# Altium project SmartCar3.0.PrjPCB
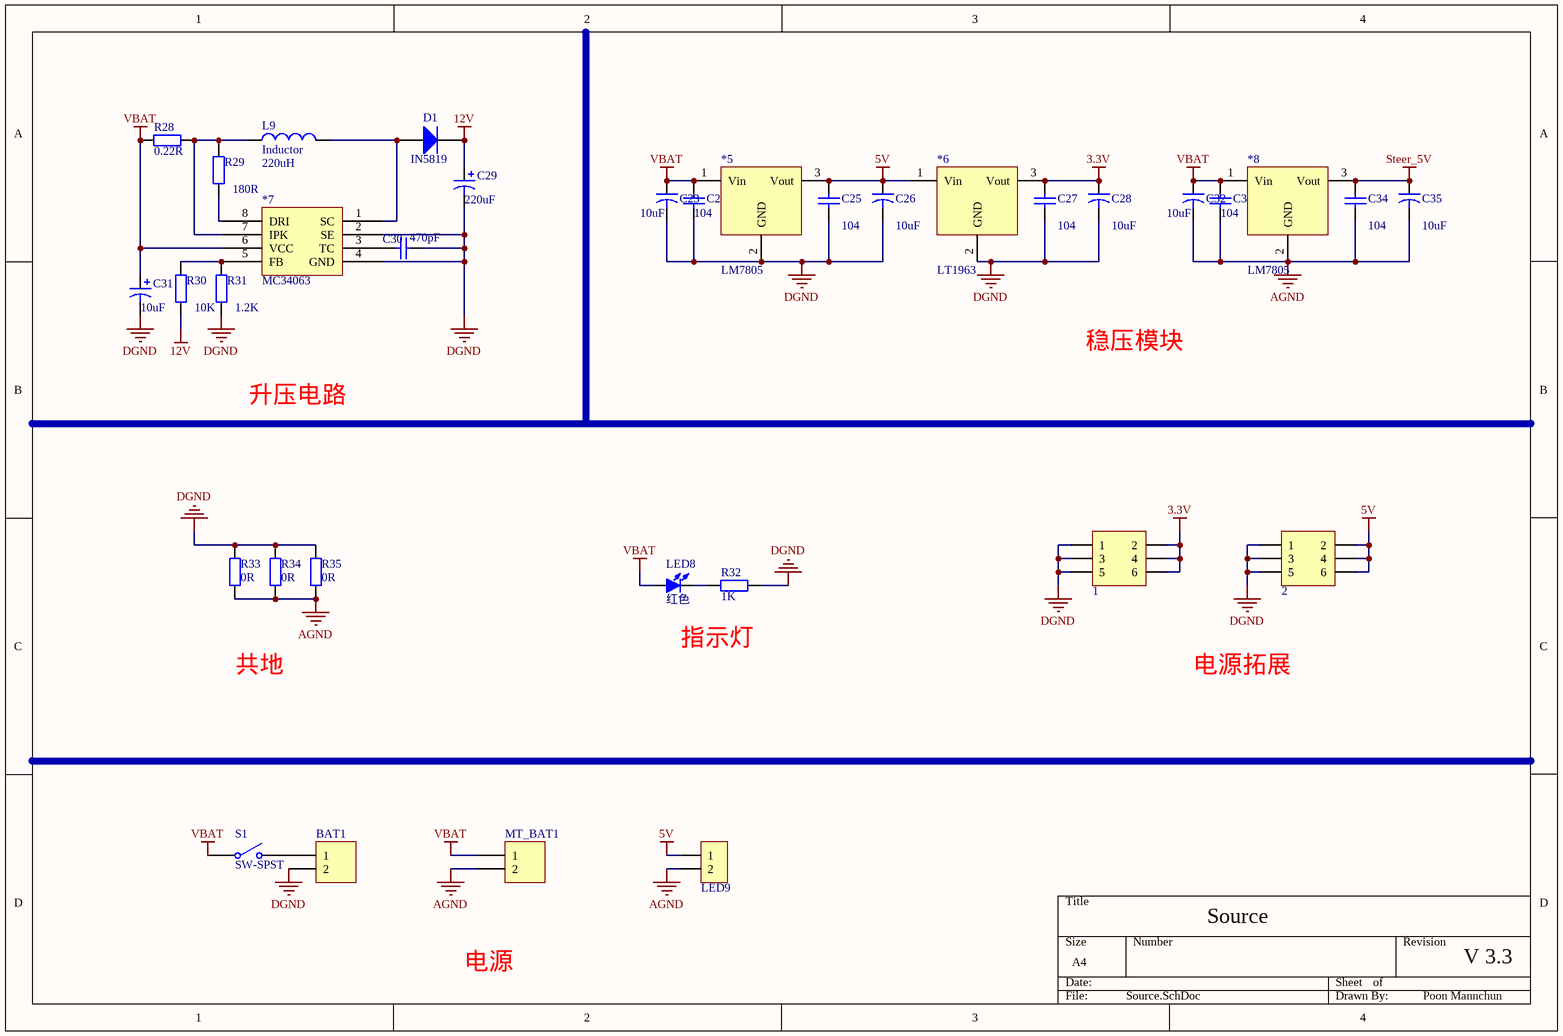
[diagram p0: Source.SchDoc]
Drawn By: Poon Mannchun; Revision: a3.3
4 sheets, 121 parts. Net scope: global (net labels, ports and power ports of the same name join across sheets).
Board files: Main.PcbDoc, MCU.PcbDoc
Sheets:
  Source.SchDoc
  CoreBoard2.SchDoc
  MCU.SchDoc
  CoreBoard1.SchDoc

## Sheet Source.SchDoc: Source
size A4; DrawnBy: Poon Mannchun; Revision: V 3.3

### Parts
1  Header3X2  [HDR-3X2]  (value not drawn)
2  Header3X2  [HDR-3X2]  (value not drawn)
*5  LM7805  [SOT223_N]
*6  LT1963  [SOT223_N]
*7  MC34063  [SOP8_N]
*8  LM7805  [SOT223_N]
BAT1  Header 2  [SW - duplicate]  (value not drawn)
C23  value 10uF  [CD A(3216)]  (hidden comment: Cap2)
C24  104  [C 0805_L]
C25  104  [C 0805_L]
C26  value 10uF  [CD A(3216)]  (hidden comment: Cap2)
C27  104  [C 0805_L]
C28  value 10uF  [CD A(3216)]  (hidden comment: Cap2)
C29  value 220uF  [CD B(3528)]  (hidden comment: Cap Pol1)
C30  value 470pF  [C 0805_L]  (hidden comment: Cap)
C31  value 10uF  [CD A(3216)]  (hidden comment: Cap Pol1)
C32  value 10uF  [CD A(3216)]  (hidden comment: Cap2)
C33  104  [C 0805_L]
C34  104  [C 0805_L]
C35  value 10uF  [CD A(3216)]  (hidden comment: Cap2)
D1  IN5819  [SMA]
L9  Inductor  value 220uH  [CDRH124]
LED8  红色  [LED 0805R]
LED9  HDR-1X2  [HDR-1X2]  (value not drawn)
MT_BAT1  Header 2  [SW - duplicate]  (value not drawn)
R28  value 0.22R  [R 0805_L]  (hidden comment: Res2)
R29  value 180R  [R 0805_L]  (hidden comment: Res2)
R30  value 10K  [R 0805_L]  (hidden comment: Res2)
R31  value 1.2K  [R 0805_L]  (hidden comment: Res2)
R32  1K  [R 0805_L]
R33  value 0R  [R 0805_L]  (hidden comment: Res2)
R34  value 0R  [R 0805_L]  (hidden comment: Res2)
R35  value 0R  [R 0805_L]  (hidden comment: Res2)
S1  SW-SPST  [MTS-10x]

### Nets
3.3V: 1.2 1.4 1.6 *6.3(Vout) C27.2 C28.1
5V: 2.2 2.4 2.6 *5.3(Vout) *6.1(Vin) C25.2 C26.1 LED9.1
12V: C29.1 D1.2(K) R30.1
AGND: *8.2(GND) C32.2 C33.1 C34.1 C35.2 LED9.2 MT_BAT1.2 R33.2 R34.2 R35.2
DGND: 1.1 1.3 1.5 2.1 2.3 2.5 *5.2(GND) *6.2(GND) *7.2(SE) *7.4(GND) BAT1.2 C23.2 C24.1 C25.1 C26.2 C27.1 C28.2 C29.2 C30.2 C31.2 R31.1 R32.2 R33.1 R34.1 R35.1
Steer_5V: *8.3(Vout) C34.2 C35.1
VBAT: *5.1(Vin) *7.6(VCC) *8.1(Vin) C23.1 C24.2 C31.1 C32.1 C33.2 LED8.1(A) MT_BAT1.1 R28.2 S1.1(COMMON)
Net*7_1: *7.1(SC) D1.1(A) L9.2
Net*7_3: *7.3(TC) C30.1
Net*7_5: *7.5(FB) R30.2 R31.2
Net*7_7: *7.7(IPK) L9.1 R28.1 R29.2
Net*7_8: *7.8(DRI) R29.1
NetBAT1_1: BAT1.1 S1.2(NO)
NetLED8_2: LED8.2(K) R32.1

### Notes on the sheet
- 稳压模块
- 升压电路
- 指示灯
- 共地
- 电源拓展
- 电源

### Library data of the parts
1 2 = Header 3X2: 3*2P接插件; 版权归属: 源创客; BOM名称: 3*2P接插件; 学习资源: www.ooocke.com
*5 *6 *8 = LM2940
BAT1 MT_BAT1 = Header 2: Header, 2-Pin; LatestRevisionDate: 17-Jul-2002; LatestRevisionNote: Re-released for DXP Platform.; Publisher: Altium Limited
C23 C26 C28 C32 C35 = Cap2: Capacitor; Published: 23-Sep-2002; PackageReference: CAPR5-4X5; Publisher: Altium Limited; PackageDescription: Capacitor; 2 Leads
C24 C25 C27 C30 C33 C34 = Cap: Capacitor; Published: 8-Jun-2000; LatestRevisionDate: 17-Jul-2002; LatestRevisionNote: Re-released for DXP Platform.; PackageReference: RAD-0.3; Publisher: Altium Limited
  C24 C25 C27 C33 C34: PackageDescription: Radial Cap, Thru-Hole; 2 Leads; 0.3 in Pin Spacing; Value: 104
C29 C31 = Cap Pol1: Polarized Capacitor (Radial); Published: 8-Jun-2000; LatestRevisionDate: 17-Jul-2002; LatestRevisionNote: Re-released for DXP Platform.; PackageReference: RB7.6-15; Publisher: Altium Limited; PackageDescription: Polarized Capacitor (Radial); 2 Leads
D1 = Diode: Default Diode; Published: 8-Jun-2000; LatestRevisionDate: 17-Jul-2002; LatestRevisionNote: Re-released for DXP Platform.; PackageVersion: Sep-1996; PackageReference: SMC; Publisher: Altium Limited; PackageDescription: DO-214-AB/SMC; 2 C-Bend Leads; Body 7.9 x 5.9 mm, inc. leads (LxW); Code_JEDEC: DO-214-AB
L9 = Inductor: Code_IEC: 1005; Published: 8-Jun-2000; LatestRevisionDate: 29-May-2009; LatestRevisionNote: IPC-7351 Footprint Added.; PackageReference: 0402-A; Publisher: Altium Limited; PackageDescription: Chip Inductor; Code_JEITA: 0402
LED8 = LED-SMD: 贴片LED; 版权归属: 源创客; BOM名称: 贴片LED; 学习资源: www.ooocke.com
LED9 = Header 2: 2P接插件; 版权归属: 源创客; BOM名称: 2P接插件; 学习资源: www.ooocke.com
R28-R35 = Res2: Resistor; Published: 8-Jun-2000; LatestRevisionDate: 17-Jul-2002; LatestRevisionNote: Re-released for DXP Platform.; PackageReference: AXIAL-0.4; Publisher: Altium Limited
  R28-R31 R33-R35: PackageDescription: Axial Device, Thru-Hole; 2 Leads; 0.4 in Pin Spacing
S1 = SW-SPST: Single-Pole, Single-Throw Switch; Published: 24-Mar-1999; LatestRevisionDate: 17-Jul-2002; LatestRevisionNote: Re-released for DXP Platform.; PackageReference: SPST-2; Publisher: Altium Limited; PackageDescription: Switch; 2 Leads

## Sheet CoreBoard2.SchDoc: MCU 2
size A4; DrawnBy: Poon Mannchun; Revision: V 3.3
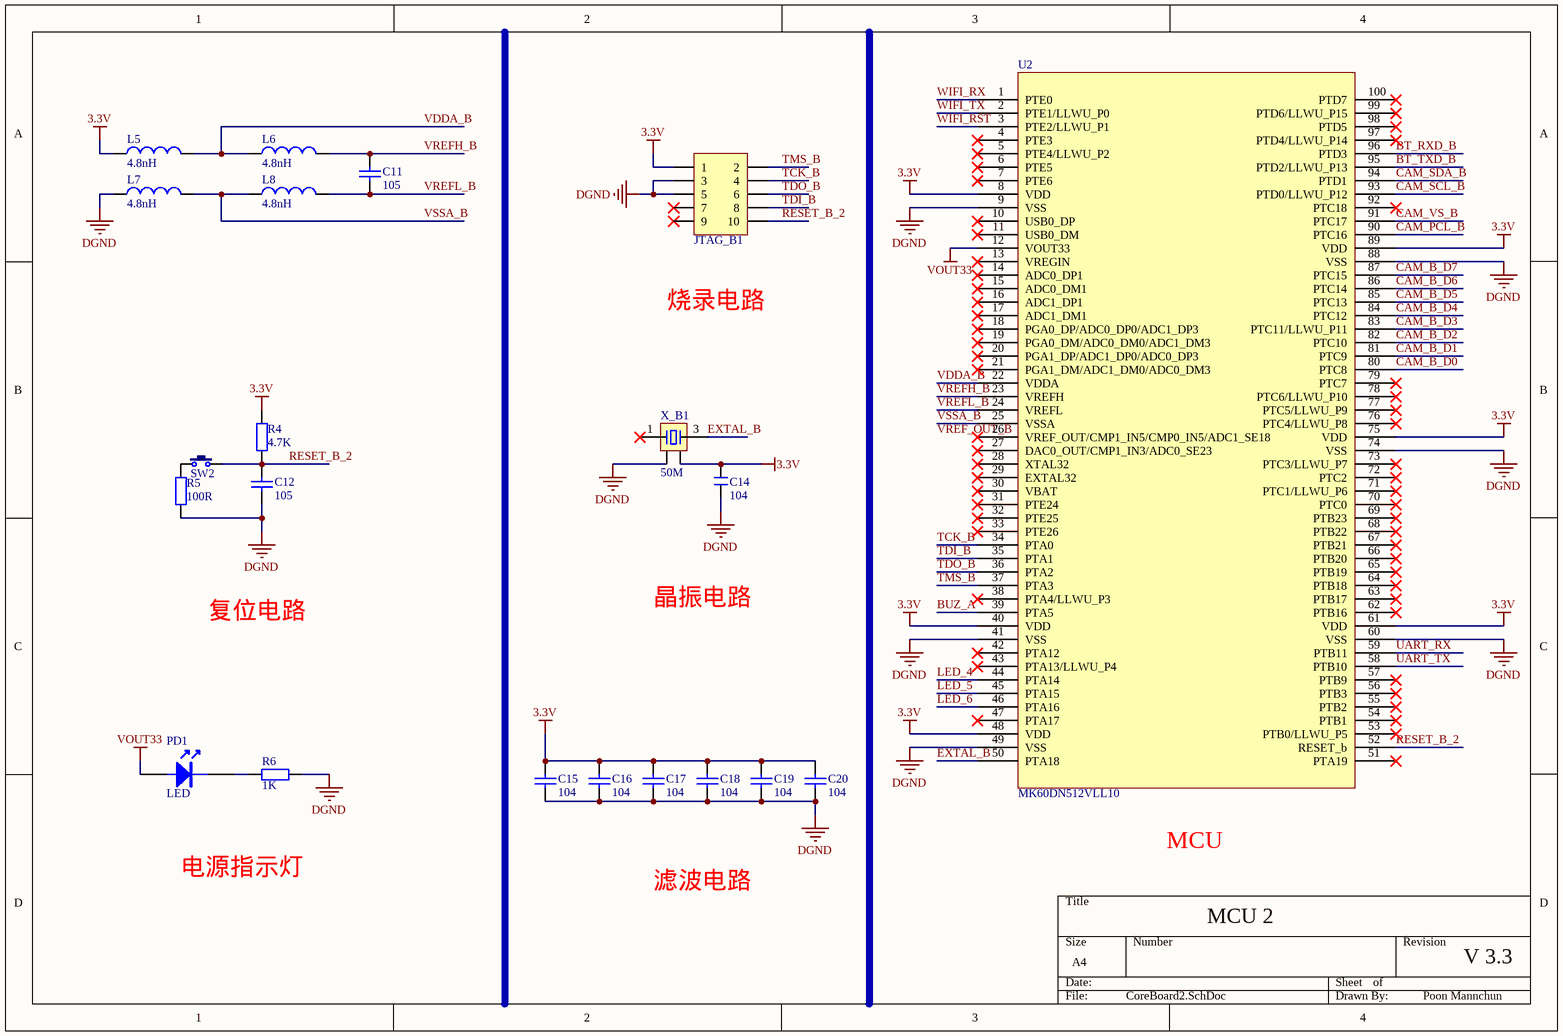
[diagram p1: CoreBoard2.SchDoc]

### Parts
C11  105  [C 0805_L]
C12  105  [C 0805_L]
C14  104  [C 0805]
C15  104  [C 0805_L]
C16  104  [C 0805_L]
C17  104  [C 0805_L]
C18  104  [C 0805_L]
C19  104  [C 0805_L]
C20  104  [C 0805_L]
JTAG_B1  Header 5X2  [HDR-5X2]  (value not drawn)
L5  4.8nH  [L 0805]
L6  4.8nH  [L 0805]
L7  4.8nH  [L 0805]
L8  4.8nH  [L 0805]
PD1  LED  [LED 0805R]
R4  4.7K  [R 0805_L]
R5  100R  [R 0805_L]
R6  1K  [R 0805_L]
SW2  3x6x5  [TSW SMD-3*6*2.5]  (value not drawn)
U2  MK60DN512VLL10  [LQFP100 14x14_N]
X_B1  50M  [OSC 5032-4P]

### Nets
3.3V: C14.2 C15.2 C16.2 C17.2 C18.2 C19.2 C20.2 JTAG_B1.1 L5.1 R4.2 U2.8(VDD) U2.40(VDD) U2.48(VDD) U2.61(VDD) U2.75(VDD) U2.89(VDD) X_B1.4
DGND: C12.1 C14.1 C15.1 C16.1 C17.1 C18.1 C19.1 C20.1 JTAG_B1.3 JTAG_B1.5 L7.1 R5.1 R6.2 U2.9(VSS) U2.41(VSS) U2.49(VSS) U2.60(VSS) U2.74(VSS) U2.88(VSS) X_B1.2
VOUT33: PD1.A U2.12(VOUT33)
BT_RXD_B: U2.96(PTD3)
BT_TXD_B: U2.95(PTD2/LLWU_P13)
BUZ_A: U2.39(PTA5)
CAM_B_D0: U2.80(PTC8)
CAM_B_D1: U2.81(PTC9)
CAM_B_D2: U2.82(PTC10)
CAM_B_D3: U2.83(PTC11/LLWU_P11)
CAM_B_D4: U2.84(PTC12)
CAM_B_D5: U2.85(PTC13)
CAM_B_D6: U2.86(PTC14)
CAM_B_D7: U2.87(PTC15)
CAM_PCL_B: U2.90(PTC16)
CAM_SCL_B: U2.93(PTD0/LLWU_P12)
CAM_SDA_B: U2.94(PTD1)
CAM_VS_B: U2.91(PTC17)
EXTAL_B: U2.50(PTA18) X_B1.3
LED_4: U2.44(PTA14)
LED_5: U2.45(PTA15)
LED_6: U2.46(PTA16)
RESET_B_2: C12.2 JTAG_B1.10 R4.1 SW2.2 U2.52(RESET_b)
TCK_B: JTAG_B1.4 U2.34(PTA0)
TDI_B: JTAG_B1.8 U2.35(PTA1)
TDO_B: JTAG_B1.6 U2.36(PTA2)
TMS_B: JTAG_B1.2 U2.37(PTA3)
UART_RX: U2.59(PTB11)
UART_TX: U2.58(PTB10)
VDDA_B: L5.2 L6.1 U2.22(VDDA)
VREFH_B: C11.2 L6.2 U2.23(VREFH)
VREFL_B: C11.1 L8.2 U2.24(VREFL)
VSSA_B: L7.2 L8.1 U2.25(VSSA)
WIFI_RST: U2.3(PTE2/LLWU_P1)
WIFI_RX: U2.1(PTE0)
WIFI_TX: U2.2(PTE1/LLWU_P0)
NetPD1_K: PD1.K R6.1
NetR5_2: R5.2 SW2.1

Not connected (* = marked no-connect by the designer): JTAG_B1 7* 9*; U2 4(PTE3)* 5(PTE4/LLWU_P2)* 6(PTE5)* 7(PTE6)* 10(USB0_DP)* 11(USB0_DM)* 13(VREGIN)* 14(ADC0_DP1)* 15(ADC0_DM1)* 16(ADC1_DP1)* 17(ADC1_DM1)* 18(PGA0_DP/ADC0_DP0/ADC1_DP3)* 19(PGA0_DM/ADC0_DM0/ADC1_DM3)* 20(PGA1_DP/ADC1_DP0/ADC0_DP3)* 21(PGA1_DM/ADC1_DM0/ADC0_DM3)* 26(VREF_OUT/CMP1_IN5/CMP0_IN5/ADC1_SE18)* 27(DAC0_OUT/CMP1_IN3/ADC0_SE23)* 28(XTAL32)* 29(EXTAL32)* 30(VBAT)* 31(PTE24)* 32(PTE25)* 33(PTE26)* 38(PTA4/LLWU_P3)* 42(PTA12)* 43(PTA13/LLWU_P4)* 47(PTA17)* 51(PTA19)* 53(PTB0/LLWU_P5)* 54(PTB1)* 55(PTB2)* 56(PTB3)* 57(PTB9)* 62(PTB16)* 63(PTB17)* 64(PTB18)* 65(PTB19)* 66(PTB20)* 67(PTB21)* 68(PTB22)* 69(PTB23)* 70(PTC0)* 71(PTC1/LLWU_P6)* 72(PTC2)* 73(PTC3/LLWU_P7)* 76(PTC4/LLWU_P8)* 77(PTC5/LLWU_P9)* 78(PTC6/LLWU_P10)* 79(PTC7)* 92(PTC18)* 97(PTD4/LLWU_P14)* 98(PTD5)* 99(PTD6/LLWU_P15)* 100(PTD7)*; X_B1 1*

### Notes on the sheet
- 烧录电路
- 复位电路
- 晶振电路
- MCU
- 电源指示灯
- 滤波电路
- Labels drawn without touching a wire or pin: VREF_OUT_B

### Library data of the parts
C11 C12 C15-C20 = CAP: Capacitor; Published: 8-Jun-2000; Revision: July-2002: Re-released for DXP Platform.; Publisher: Altium Limited
C14 = C: 无极性贴片电容; 版权归属: 源创客; BOM名称: 无极性贴片电容; 学习资源: www.ooocke.com
JTAG_B1 = Header 5X2: 5*2P接插件; 版权归属: 源创客; BOM名称: 5*2P接插件; 学习资源: www.ooocke.com
L5-L8 = Inductor: Code_IEC: 1005; Published: 8-Jun-2000; LatestRevisionDate: 17-Jul-2002; LatestRevisionNote: Re-released for DXP Platform.; PackageReference: 0402-A; Publisher: Altium Limited; Code_JEITA: 0402
PD1 = LED: pin to pad: A>1 K>2
R4-R6 = Res2: Resistor; Published: 8-Jun-2000; LatestRevisionDate: 17-Jul-2002; LatestRevisionNote: Re-released for DXP Platform.; PackageReference: AXIAL-0.4; Publisher: Altium Limited
SW2 = TSW 3x6: 3x6轻触开关; 版权归属: 源创客; BOM名称: 3x6轻触开关; 学习资源: www.ooocke.com
U2 = MK60DN512ZVLQ10: MK60DN512ZVLL10
X_B1 = XTAL-4: 4脚晶振; 版权归属: 源创客; BOM名称: 4脚晶振; 学习资源: www.ooocke.com

## Sheet MCU.SchDoc: Module
size A4; DrawnBy: Poon Mannchun; Revision: V 3.3
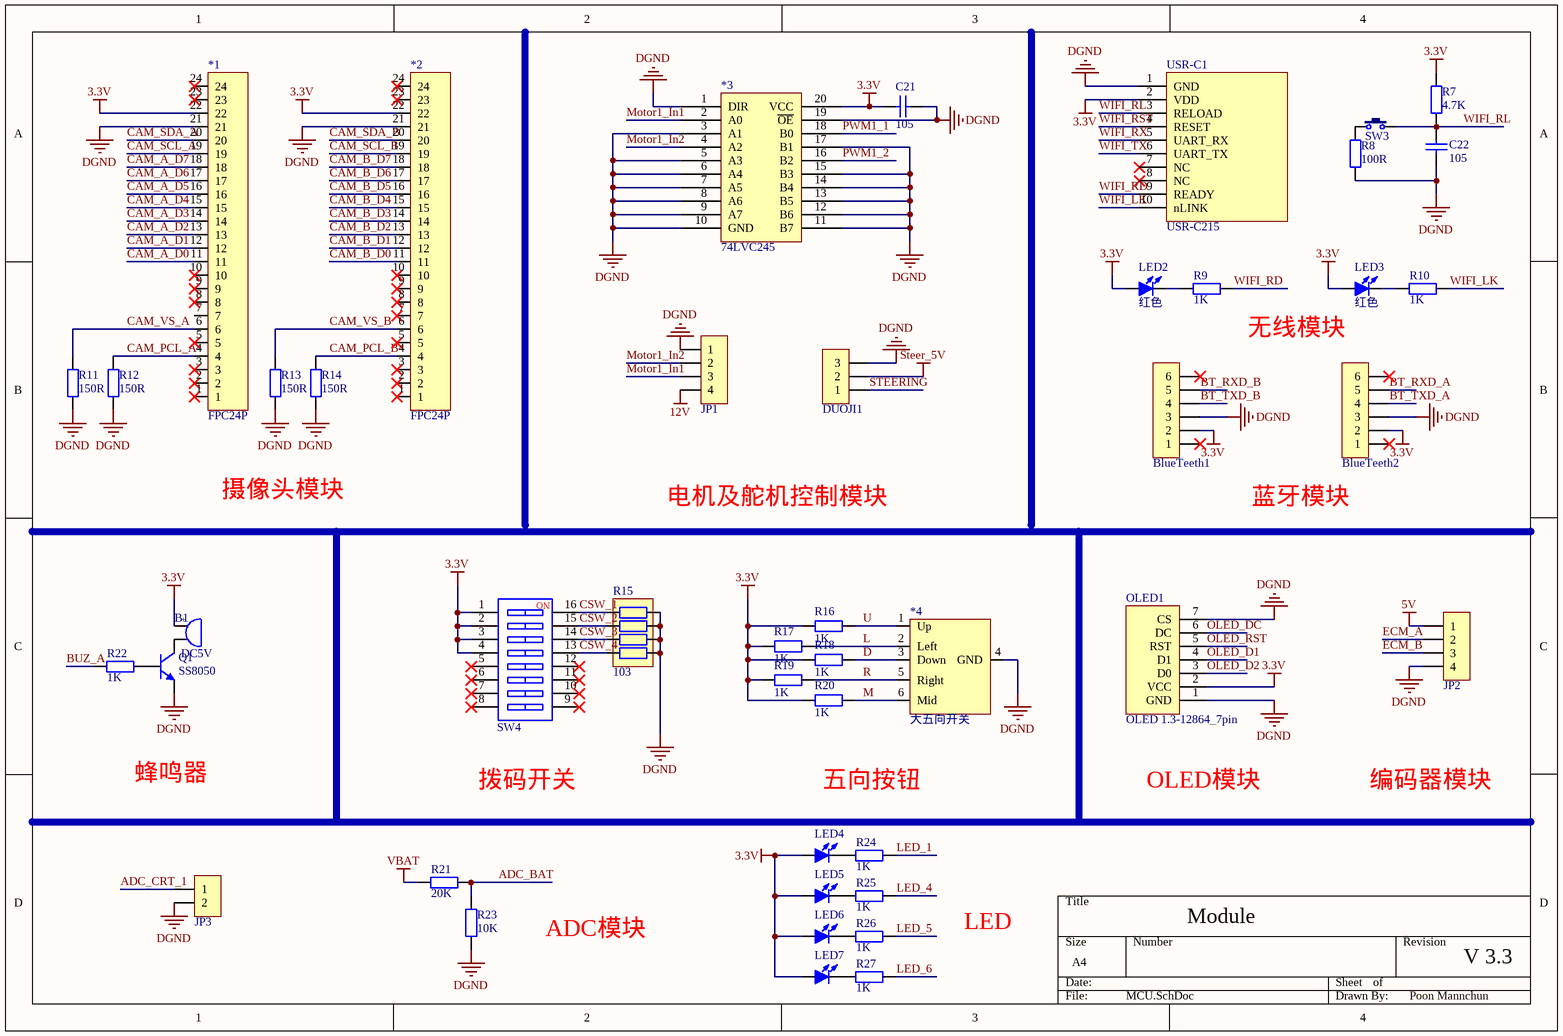
[diagram p2: MCU.SchDoc]

### Parts
*1  FPC24P  [FH12-24S-0.5SV]
*2  FPC24P  [FH12-24S-0.5SV]
*3  74LVC245  [TSSOP-20]  (value not drawn)
*4  大五向开关  [五向]
B1  DC5V  [BEEP 5x9x5.5]
BlueTeeth1  HDR-1X6  [HDR2.54-LI-6P]  (value not drawn)
BlueTeeth2  HDR-1X6  [HDR2.54-LI-6P]  (value not drawn)
C21  105  [C 0805_L]
C22  105  [C 0805_L]
DUOJI1  HDR-1X3  [HDR2.54-LI-3P]  (value not drawn)
JP1  HDR-1X4  [HDR2.54-LI-4P]  (value not drawn)
JP2  HDR-1X4  [HDR2.54-LI-4P]  (value not drawn)
JP3  HDR-1X2  [HDR2.54-LI-2P]  (value not drawn)
LED2  红色  [LED 0805B]
LED3  红色  [LED 0805B]
LED4  红色  [LED 0805B]  (value not drawn)
LED5  红色  [LED 0805B]  (value not drawn)
LED6  红色  [LED 0805B]  (value not drawn)
LED7  红色  [LED 0805B]  (value not drawn)
OLED1  OLED 1.3-12864_7pin  [HDR2.54-M-LI-7P]
Q1  SS8050  [SOT23-3L]
R7  4.7K  [R 0805_L]
R8  100R  [R 0805_L]
R9  1K  [R 0805_L]
R10  1K  [R 0805_L]
R11  150R  [R 0805_L]
R12  150R  [R 0805_L]
R13  150R  [R 0805_L]
R14  150R  [R 0805_L]
R15  103  [RCA-8P4R-0603]
R16  1K  [R 0805_L]
R17  1K  [R 0805_L]
R18  1K  [R 0805_L]
R19  1K  [R 0805_L]
R20  1K  [R 0805_L]
R21  20K  [R 0805_L]
R22  1K  [R 0805_L]
R23  10K  [R 0805_L]
R24  1K  [R 0805_L]
R25  1K  [R 0805_L]
R26  1K  [R 0805_L]
R27  1K  [R 0805_L]
SW3  3x6x5  [TSW SMD-3*6*2.5]  (value not drawn)
SW4  CSW-8P  [CSW1.27 SMD-8P]  (value not drawn)
USR-C1  USR-C215  [DIP2.0*1-10-M]

### Nets
3.3V: *1.22 *2.22 *3.20(VCC) B1.1 BlueTeeth1.2 BlueTeeth2.2 C21.2 LED2.1(A) LED3.1(A) LED4.1(A) LED5.1(A) LED6.1(A) LED7.1(A) OLED1.2(VCC) R7.2 R16.1 R17.1 R18.1 R19.1 R20.1 SW4.1 SW4.2 SW4.3 SW4.4 USR-C1.2(VDD)
5V: JP2.1
12V: JP1.4
DGND: *1.21 *2.21 *3.1(DIR) *3.3(A1) *3.5(A3) *3.6(A4) *3.7(A5) *3.8(A6) *3.9(A7) *3.10(GND) *3.11(B7) *3.12(B6) *3.13(B5) *3.14(B4) *3.15(B3) *3.17(B1) *3.19(~{OE}) *4.4(GND) BlueTeeth1.3 BlueTeeth2.3 C21.1 C22.1 DUOJI1.3 JP1.1 JP2.4 JP3.2 OLED1.1(GND) OLED1.7(CS) Q1.2(E) R8.1 R11.1 R12.1 R13.1 R14.1 R15.5 R15.6 R15.7 R15.8 R23.1 USR-C1.1(GND)
Steer_5V: DUOJI1.2
VBAT: R21.1
ADC_BAT: R21.2 R23.2
ADC_CRT_1: JP3.1
BT_RXD_A: BlueTeeth2.5
BT_RXD_B: BlueTeeth1.5
BT_TXD_A: BlueTeeth2.4
BT_TXD_B: BlueTeeth1.4
BUZ_A: R22.1
CAM_A_D0: *1.11
CAM_A_D1: *1.12
CAM_A_D2: *1.13
CAM_A_D3: *1.14
CAM_A_D4: *1.15
CAM_A_D5: *1.16
CAM_A_D6: *1.17
CAM_A_D7: *1.18
CAM_B_D0: *2.11
CAM_B_D1: *2.12
CAM_B_D2: *2.13
CAM_B_D3: *2.14
CAM_B_D4: *2.15
CAM_B_D5: *2.16
CAM_B_D6: *2.17
CAM_B_D7: *2.18
CAM_PCL_A: *1.4 R12.2
CAM_PCL_B: *2.4 R14.2
CAM_SCL_A: *1.19
CAM_SCL_B: *2.19
CAM_SDA_A: *1.20
CAM_SDA_B: *2.20
CAM_VS_A: *1.6 R11.2
CAM_VS_B: *2.6 R13.2
CSW_1: R15.1 SW4.16
CSW_2: R15.2 SW4.15
CSW_3: R15.3 SW4.14
CSW_4: R15.4 SW4.13
D: *4.3(Down) R18.2
ECM_A: JP2.2
ECM_B: JP2.3
L: *4.2(Left) R17.2
LED_1: R24.2
LED_4: R25.2
LED_5: R26.2
LED_6: R27.2
M: *4.6(Mid) R20.2
Motor1_In1: *3.2(A0) JP1.3
Motor1_In2: *3.4(A2) JP1.2
OLED_D1: OLED1.4(D1)
OLED_D2: OLED1.3(D0)
OLED_DC: OLED1.6(DC)
OLED_RST: OLED1.5(RST)
PWM1_1: *3.18(B0)
PWM1_2: *3.16(B2)
R: *4.5(Right) R19.2
STEERING: DUOJI1.1
U: *4.1(Up) R16.2
WIFI_LK: R10.2 USR-C1.10(nLINK)
WIFI_RD: R9.2 USR-C1.9(READY)
WIFI_RL: C22.2 R7.1 SW3.2 USR-C1.3(RELOAD)
WIFI_RST: USR-C1.4(RESET)
WIFI_RX: USR-C1.5(UART_RX)
WIFI_TX: USR-C1.6(UART_TX)
NetB1_2: B1.2 Q1.3(C)
NetLED2_2: LED2.2(K) R9.1
NetLED3_2: LED3.2(K) R10.1
NetLED4_2: LED4.2(K) R24.1
NetLED5_2: LED5.2(K) R25.1
NetLED6_2: LED6.2(K) R26.1
NetLED7_2: LED7.2(K) R27.1
NetQ1_1: Q1.1(B) R22.2
NetR8_2: R8.2 SW3.1

Not connected (* = marked no-connect by the designer): *1 1* 2* 3* 5* 7 8* 9* 10* 23* 24*; *2 1* 2* 3* 5* 7* 8* 9* 10* 23* 24*; BlueTeeth1 1* 6*; BlueTeeth2 1* 6*; SW4 5* 6* 7* 8* 9* 10* 11* 12*; USR-C1 7(NC)* 8(NC)*

### Notes on the sheet
- (near R9) 无线模块
- 摄像头模块
- 电机及舵机控制模块
- 蓝牙模块
- 蜂鸣器
- 拨码开关
- 五向按钮
- OLED模块
- 编码器模块
- ADC模块
- LED
- (in symbol BEEP) +
- (in symbol CSW-8P) NO

### Library data of the parts
B1 = BEEP: 蜂鸣器; 版权归属: 源创客; BOM名称: 蜂鸣器; 学习资源: www.ooocke.com
BlueTeeth1 BlueTeeth2 = Header 6: 6P接插件; 版权归属: 源创客; BOM名称: 6P接插件; 学习资源: www.ooocke.com
C21 C22 = CAP: Capacitor; Published: 8-Jun-2000; Revision: July-2002: Re-released for DXP Platform.; Publisher: Altium Limited
DUOJI1 = Header 3: 3P接插件; 版权归属: 源创客; BOM名称: 3P接插件; 学习资源: www.ooocke.com
JP1 JP2 = Header 4: 4P接插件; 版权归属: 源创客; BOM名称: 4P接插件; 学习资源: www.ooocke.com
JP3 = Header 2: 2P接插件; 版权归属: 源创客; BOM名称: 2P接插件; 学习资源: www.ooocke.com
LED2-LED7 = LED-SMD: 贴片LED; 版权归属: 源创客; BOM名称: 贴片LED; 学习资源: www.ooocke.com
OLED1 = OLED 1.3-12864_7pin: 12864 点阵屏; 版权归属: 源创客; BOM名称: 12864 点阵屏; 学习资源: www.ooocke.com
Q1 = 8050-SMD: 高频放大-NPN型; 版权归属: 源创客; 属性: 40V 1.5A 1W 100MHZ; BOM名称: 高频放大-NPN型; 学习资源: www.ooocke.com
R7-R14 R21-R27 = Res2: Resistor; Published: 8-Jun-2000; LatestRevisionDate: 17-Jul-2002; LatestRevisionNote: Re-released for DXP Platform.; PackageReference: AXIAL-0.4; Publisher: Altium Limited
R15 = R-8P4R: 贴片网络排阻; 版权归属: 源创客; BOM名称: 贴片网络排阻; 学习资源: www.ooocke.com
R16-R20 = R: 贴片电阻; 版权归属: 源创客; BOM名称: 贴片电阻; 学习资源: www.ooocke.com
SW3 = TSW 3x6: 3x6轻触开关; 版权归属: 源创客; BOM名称: 3x6轻触开关; 学习资源: www.ooocke.com
SW4 = CSW-8P: 8路编码开关; 版权归属: 源创客; BOM名称: 8路编码开关; 学习资源: www.ooocke.com
USR-C1 = USR-C215: LatestRevisionDate: *; LatestRevisionNote: *; Publisher: *

## Sheet CoreBoard1.SchDoc: MCU 1
size A4; DrawnBy: Poon Mannchun; Revision: V 3.3
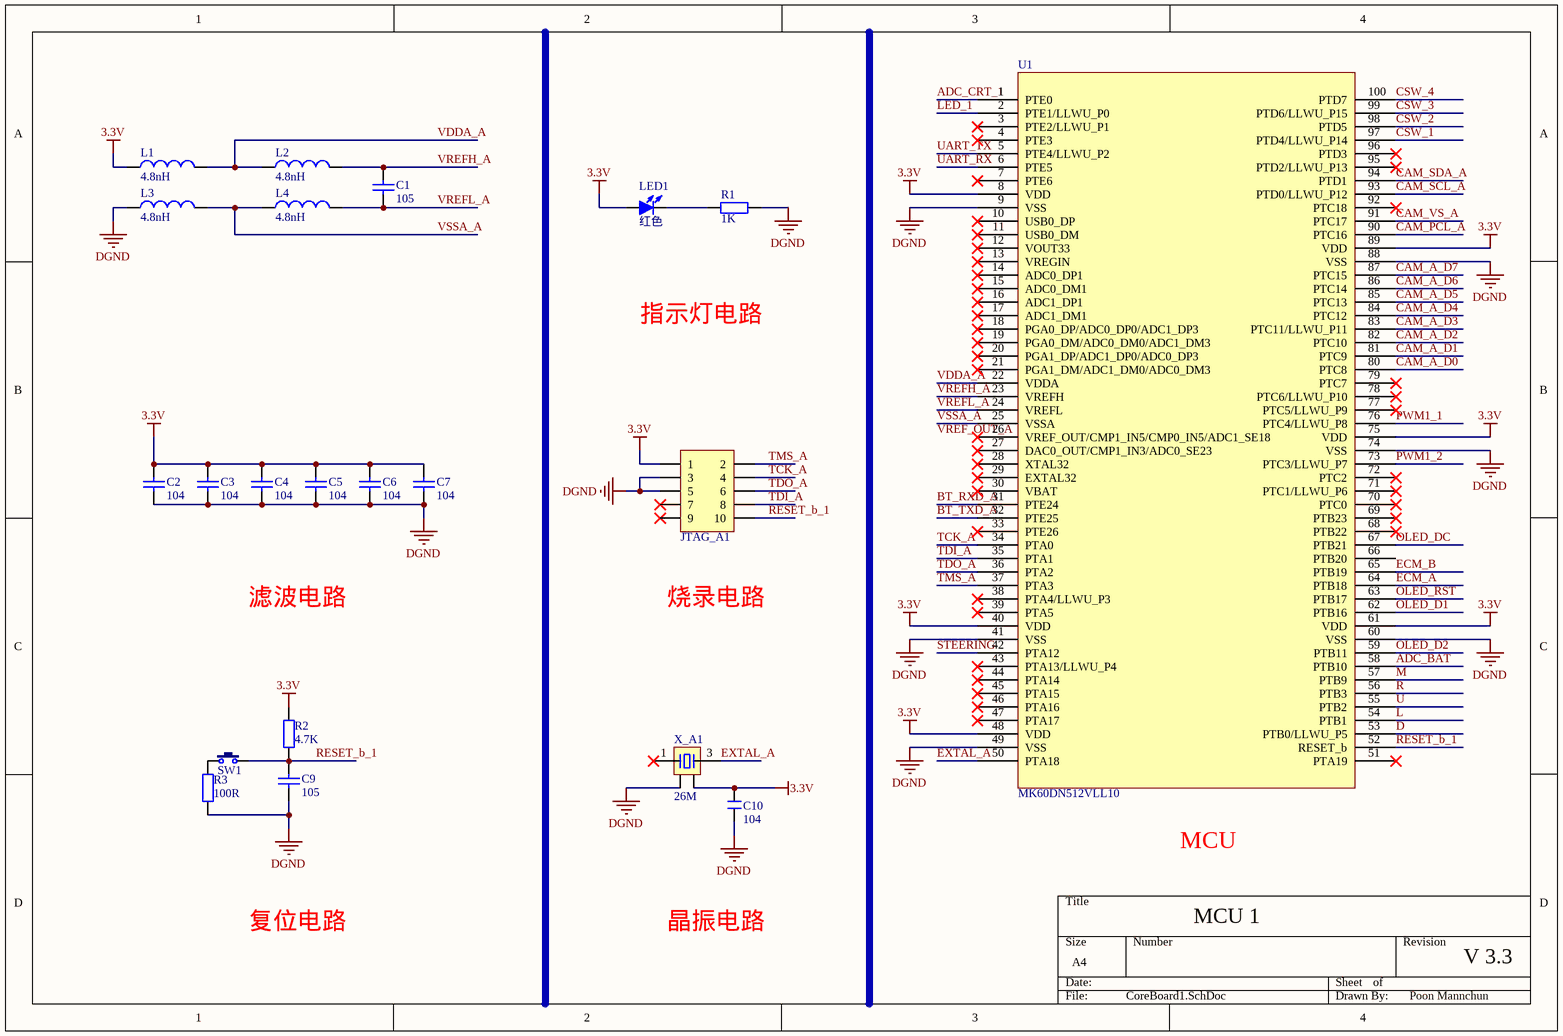
[diagram p3: CoreBoard1.SchDoc]

### Parts
C1  105  [C 0805_L]
C2  104  [C 0805_L]
C3  104  [C 0805_L]
C4  104  [C 0805_L]
C5  104  [C 0805_L]
C6  104  [C 0805_L]
C7  104  [C 0805_L]
C9  105  [C 0805_L]
C10  104  [C 0805]
JTAG_A1  Header 5X2  [HDR-5X2]  (value not drawn)
L1  4.8nH  [L 0805]
L2  4.8nH  [L 0805]
L3  4.8nH  [L 0805]
L4  4.8nH  [L 0805]
LED1  红色  [LED 0805B]
R1  1K  [R 0805_L]
R2  4.7K  [R 0805_L]
R3  100R  [R 0805_L]
SW1  3x6x5  [TSW SMD-3*6*2.5]  (value not drawn)
U1  MK60DN512VLL10  [LQFP100 14x14_N]
X_A1  26M  [OSC 5032-4P]

### Nets
3.3V: C2.2 C3.2 C4.2 C5.2 C6.2 C7.2 C10.2 JTAG_A1.1 L1.1 LED1.1(A) R2.2 U1.8(VDD) U1.40(VDD) U1.48(VDD) U1.61(VDD) U1.75(VDD) U1.89(VDD) X_A1.4
DGND: C2.1 C3.1 C4.1 C5.1 C6.1 C7.1 C9.1 C10.1 JTAG_A1.3 JTAG_A1.5 L3.1 R1.2 R3.1 U1.9(VSS) U1.41(VSS) U1.49(VSS) U1.60(VSS) U1.74(VSS) U1.88(VSS) X_A1.2
ADC_BAT: U1.58(PTB10)
ADC_CRT_1: U1.1(PTE0)
BT_RXD_A: U1.31(PTE24)
BT_TXD_A: U1.32(PTE25)
CAM_A_D0: U1.80(PTC8)
CAM_A_D1: U1.81(PTC9)
CAM_A_D2: U1.82(PTC10)
CAM_A_D3: U1.83(PTC11/LLWU_P11)
CAM_A_D4: U1.84(PTC12)
CAM_A_D5: U1.85(PTC13)
CAM_A_D6: U1.86(PTC14)
CAM_A_D7: U1.87(PTC15)
CAM_PCL_A: U1.90(PTC16)
CAM_SCL_A: U1.93(PTD0/LLWU_P12)
CAM_SDA_A: U1.94(PTD1)
CAM_VS_A: U1.91(PTC17)
CSW_1: U1.97(PTD4/LLWU_P14)
CSW_2: U1.98(PTD5)
CSW_3: U1.99(PTD6/LLWU_P15)
CSW_4: U1.100(PTD7)
D: U1.53(PTB0/LLWU_P5)
ECM_A: U1.64(PTB18)
ECM_B: U1.65(PTB19)
EXTAL_A: U1.50(PTA18) X_A1.3
L: U1.54(PTB1)
LED_1: U1.2(PTE1/LLWU_P0)
M: U1.57(PTB9)
OLED_D1: U1.62(PTB16)
OLED_D2: U1.59(PTB11)
OLED_DC: U1.67(PTB21)
OLED_RST: U1.63(PTB17)
PWM1_1: U1.76(PTC4/LLWU_P8)
PWM1_2: U1.73(PTC3/LLWU_P7)
R: U1.56(PTB3)
RESET_b_1: C9.2 JTAG_A1.10 R2.1 SW1.2 U1.52(RESET_b)
STEERING: U1.42(PTA12)
TCK_A: JTAG_A1.4 U1.34(PTA0)
TDI_A: JTAG_A1.8 U1.35(PTA1)
TDO_A: JTAG_A1.6 U1.36(PTA2)
TMS_A: JTAG_A1.2 U1.37(PTA3)
U: U1.55(PTB2)
UART_RX: U1.6(PTE5)
UART_TX: U1.5(PTE4/LLWU_P2)
VDDA_A: L1.2 L2.1 U1.22(VDDA)
VREFH_A: C1.2 L2.2 U1.23(VREFH)
VREFL_A: C1.1 L4.2 U1.24(VREFL)
VSSA_A: L3.2 L4.1 U1.25(VSSA)
NetLED1_2: LED1.2(K) R1.1
NetR3_2: R3.2 SW1.1

Not connected (* = marked no-connect by the designer): JTAG_A1 7* 9*; U1 3(PTE2/LLWU_P1)* 4(PTE3)* 7(PTE6)* 10(USB0_DP)* 11(USB0_DM)* 12(VOUT33)* 13(VREGIN)* 14(ADC0_DP1)* 15(ADC0_DM1)* 16(ADC1_DP1)* 17(ADC1_DM1)* 18(PGA0_DP/ADC0_DP0/ADC1_DP3)* 19(PGA0_DM/ADC0_DM0/ADC1_DM3)* 20(PGA1_DP/ADC1_DP0/ADC0_DP3)* 21(PGA1_DM/ADC1_DM0/ADC0_DM3)* 26(VREF_OUT/CMP1_IN5/CMP0_IN5/ADC1_SE18)* 27(DAC0_OUT/CMP1_IN3/ADC0_SE23)* 28(XTAL32)* 29(EXTAL32)* 30(VBAT)* 33(PTE26)* 38(PTA4/LLWU_P3)* 39(PTA5)* 43(PTA13/LLWU_P4)* 44(PTA14)* 45(PTA15)* 46(PTA16)* 47(PTA17)* 51(PTA19)* 66(PTB20) 68(PTB22)* 69(PTB23)* 70(PTC0)* 71(PTC1/LLWU_P6)* 72(PTC2)* 77(PTC5/LLWU_P9)* 78(PTC6/LLWU_P10)* 79(PTC7)* 92(PTC18)* 95(PTD2/LLWU_P13)* 96(PTD3)*; X_A1 1*

### Notes on the sheet
- 指示灯电路
- 滤波电路
- 烧录电路
- MCU
- 复位电路
- 晶振电路
- Labels drawn without touching a wire or pin: VREF_OUT_A

### Library data of the parts
C1-C7 C9 = CAP: Capacitor; Published: 8-Jun-2000; Revision: July-2002: Re-released for DXP Platform.; Publisher: Altium Limited
C10 = C: 无极性贴片电容; 版权归属: 源创客; BOM名称: 无极性贴片电容; 学习资源: www.ooocke.com
JTAG_A1 = Header 5X2: 5*2P接插件; 版权归属: 源创客; BOM名称: 5*2P接插件; 学习资源: www.ooocke.com
L1-L4 = Inductor: Code_IEC: 1005; Published: 8-Jun-2000; LatestRevisionDate: 17-Jul-2002; LatestRevisionNote: Re-released for DXP Platform.; PackageReference: 0402-A; Publisher: Altium Limited; Code_JEITA: 0402
LED1 = LED-SMD: 贴片LED; 版权归属: 源创客; BOM名称: 贴片LED; 学习资源: www.ooocke.com
R1-R3 = Res2: Resistor; Published: 8-Jun-2000; LatestRevisionDate: 17-Jul-2002; LatestRevisionNote: Re-released for DXP Platform.; PackageReference: AXIAL-0.4; Publisher: Altium Limited
SW1 = TSW 3x6: 3x6轻触开关; 版权归属: 源创客; BOM名称: 3x6轻触开关; 学习资源: www.ooocke.com
U1 = MK60DN512ZVLQ10: MK60DN512ZVLL10
X_A1 = XTAL-4: 4脚晶振; 版权归属: 源创客; BOM名称: 4脚晶振; 学习资源: www.ooocke.com

## Nets that join several sheets
3.3V: Source (6 pins), CoreBoard2 (17 pins), MCU (25 pins), CoreBoard1 (18 pins)
5V: Source (8 pins), MCU (JP2.1)
12V: Source (C29.1 D1.2 R30.1), MCU (JP1.4)
DGND: Source (25 pins), CoreBoard2 (20 pins), MCU (40 pins), CoreBoard1 (20 pins)
Steer_5V: Source (*8.3 C34.2 C35.1), MCU (DUOJI1.2)
VBAT: Source (12 pins), MCU (R21.1)
ADC_BAT: MCU (R21.2 R23.2), CoreBoard1 (U1.58)
ADC_CRT_1: MCU (JP3.1), CoreBoard1 (U1.1)
BT_RXD_A: MCU (BlueTeeth2.5), CoreBoard1 (U1.31)
BT_RXD_B: CoreBoard2 (U2.96), MCU (BlueTeeth1.5)
BT_TXD_A: MCU (BlueTeeth2.4), CoreBoard1 (U1.32)
BT_TXD_B: CoreBoard2 (U2.95), MCU (BlueTeeth1.4)
BUZ_A: CoreBoard2 (U2.39), MCU (R22.1)
CAM_A_D0: MCU (*1.11), CoreBoard1 (U1.80)
CAM_A_D1: MCU (*1.12), CoreBoard1 (U1.81)
CAM_A_D2: MCU (*1.13), CoreBoard1 (U1.82)
CAM_A_D3: MCU (*1.14), CoreBoard1 (U1.83)
CAM_A_D4: MCU (*1.15), CoreBoard1 (U1.84)
CAM_A_D5: MCU (*1.16), CoreBoard1 (U1.85)
CAM_A_D6: MCU (*1.17), CoreBoard1 (U1.86)
CAM_A_D7: MCU (*1.18), CoreBoard1 (U1.87)
CAM_B_D0: CoreBoard2 (U2.80), MCU (*2.11)
CAM_B_D1: CoreBoard2 (U2.81), MCU (*2.12)
CAM_B_D2: CoreBoard2 (U2.82), MCU (*2.13)
CAM_B_D3: CoreBoard2 (U2.83), MCU (*2.14)
CAM_B_D4: CoreBoard2 (U2.84), MCU (*2.15)
CAM_B_D5: CoreBoard2 (U2.85), MCU (*2.16)
CAM_B_D6: CoreBoard2 (U2.86), MCU (*2.17)
CAM_B_D7: CoreBoard2 (U2.87), MCU (*2.18)
CAM_PCL_A: MCU (*1.4 R12.2), CoreBoard1 (U1.90)
CAM_PCL_B: CoreBoard2 (U2.90), MCU (*2.4 R14.2)
CAM_SCL_A: MCU (*1.19), CoreBoard1 (U1.93)
CAM_SCL_B: CoreBoard2 (U2.93), MCU (*2.19)
CAM_SDA_A: MCU (*1.20), CoreBoard1 (U1.94)
CAM_SDA_B: CoreBoard2 (U2.94), MCU (*2.20)
CAM_VS_A: MCU (*1.6 R11.2), CoreBoard1 (U1.91)
CAM_VS_B: CoreBoard2 (U2.91), MCU (*2.6 R13.2)
CSW_1: MCU (R15.1 SW4.16), CoreBoard1 (U1.97)
CSW_2: MCU (R15.2 SW4.15), CoreBoard1 (U1.98)
CSW_3: MCU (R15.3 SW4.14), CoreBoard1 (U1.99)
CSW_4: MCU (R15.4 SW4.13), CoreBoard1 (U1.100)
D: MCU (*4.3 R18.2), CoreBoard1 (U1.53)
ECM_A: MCU (JP2.2), CoreBoard1 (U1.64)
ECM_B: MCU (JP2.3), CoreBoard1 (U1.65)
L: MCU (*4.2 R17.2), CoreBoard1 (U1.54)
LED_1: MCU (R24.2), CoreBoard1 (U1.2)
LED_4: CoreBoard2 (U2.44), MCU (R25.2)
LED_5: CoreBoard2 (U2.45), MCU (R26.2)
LED_6: CoreBoard2 (U2.46), MCU (R27.2)
M: MCU (*4.6 R20.2), CoreBoard1 (U1.57)
OLED_D1: MCU (OLED1.4), CoreBoard1 (U1.62)
OLED_D2: MCU (OLED1.3), CoreBoard1 (U1.59)
OLED_DC: MCU (OLED1.6), CoreBoard1 (U1.67)
OLED_RST: MCU (OLED1.5), CoreBoard1 (U1.63)
PWM1_1: MCU (*3.18), CoreBoard1 (U1.76)
PWM1_2: MCU (*3.16), CoreBoard1 (U1.73)
R: MCU (*4.5 R19.2), CoreBoard1 (U1.56)
STEERING: MCU (DUOJI1.1), CoreBoard1 (U1.42)
U: MCU (*4.1 R16.2), CoreBoard1 (U1.55)
UART_RX: CoreBoard2 (U2.59), CoreBoard1 (U1.6)
UART_TX: CoreBoard2 (U2.58), CoreBoard1 (U1.5)
WIFI_RST: CoreBoard2 (U2.3), MCU (USR-C1.4)
WIFI_RX: CoreBoard2 (U2.1), MCU (USR-C1.5)
WIFI_TX: CoreBoard2 (U2.2), MCU (USR-C1.6)